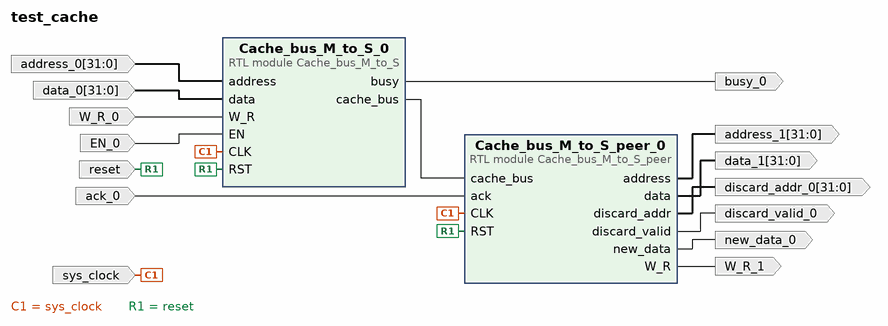
[diagram p0: block diagram of the top level]
# Vivado block design test_cache, xc7a100tcsg324-1, Vivado 2019.1
create_bd_design test_cache

create_bd_port -dir I -type rst reset
set_property -dict {CONFIG.POLARITY ACTIVE_LOW} [get_bd_ports reset]
create_bd_port -dir I -type clk sys_clock
set_property -dict {CONFIG.FREQ_HZ 100000000 CONFIG.PHASE 0.000} [get_bd_ports sys_clock]
create_bd_port -dir I -from 31 -to 0 address_0
create_bd_port -dir I -from 31 -to 0 data_0
create_bd_port -dir I W_R_0
create_bd_port -dir I EN_0
create_bd_port -dir O -from 31 -to 0 address_1
create_bd_port -dir O -from 31 -to 0 data_1
create_bd_port -dir O W_R_1
create_bd_port -dir O -from 31 -to 0 discard_addr_0
create_bd_port -dir O discard_valid_0
create_bd_port -dir O new_data_0
create_bd_port -dir I ack_0
create_bd_port -dir O busy_0

create_bd_cell -type module -reference Cache_bus_M_to_S_peer Cache_bus_M_to_S_peer_0
create_bd_cell -type module -reference Cache_bus_M_to_S Cache_bus_M_to_S_0

# ---- connections ----

connect_bd_net -net clk_wiz_clk_out1 [get_bd_ports sys_clock] [get_bd_pins Cache_bus_M_to_S_peer_0/CLK] [get_bd_pins Cache_bus_M_to_S_0/CLK]
connect_bd_net -net rst_clk_wiz_100M_peripheral_aresetn [get_bd_ports reset] \
  [get_bd_pins Cache_bus_M_to_S_peer_0/RST] [get_bd_pins Cache_bus_M_to_S_0/RST]
connect_bd_net -net address_0_1 [get_bd_ports address_0] [get_bd_pins Cache_bus_M_to_S_0/address]
connect_bd_net -net data_0_1 [get_bd_ports data_0] [get_bd_pins Cache_bus_M_to_S_0/data]
connect_bd_net -net W_R_0_1 [get_bd_ports W_R_0] [get_bd_pins Cache_bus_M_to_S_0/W_R]
connect_bd_net -net EN_0_1 [get_bd_ports EN_0] [get_bd_pins Cache_bus_M_to_S_0/EN]
connect_bd_net [get_bd_pins Cache_bus_M_to_S_0/cache_bus] [get_bd_pins Cache_bus_M_to_S_peer_0/cache_bus]
connect_bd_net [get_bd_pins Cache_bus_M_to_S_peer_0/new_data] [get_bd_ports new_data_0]
connect_bd_net -net ack_0_1 [get_bd_ports ack_0] [get_bd_pins Cache_bus_M_to_S_peer_0/ack]
connect_bd_net [get_bd_pins Cache_bus_M_to_S_peer_0/address] [get_bd_ports address_1]
connect_bd_net [get_bd_pins Cache_bus_M_to_S_peer_0/W_R] [get_bd_ports W_R_1]
connect_bd_net [get_bd_pins Cache_bus_M_to_S_peer_0/data] [get_bd_ports data_1]
connect_bd_net [get_bd_pins Cache_bus_M_to_S_peer_0/discard_valid] [get_bd_ports discard_valid_0]
connect_bd_net [get_bd_pins Cache_bus_M_to_S_peer_0/discard_addr] [get_bd_ports discard_addr_0]
connect_bd_net [get_bd_pins Cache_bus_M_to_S_0/busy] [get_bd_ports busy_0]

validate_bd_design
save_bd_design
